# EAGLE design multiple frequency divider 1.1 (EAGLE 6.4)
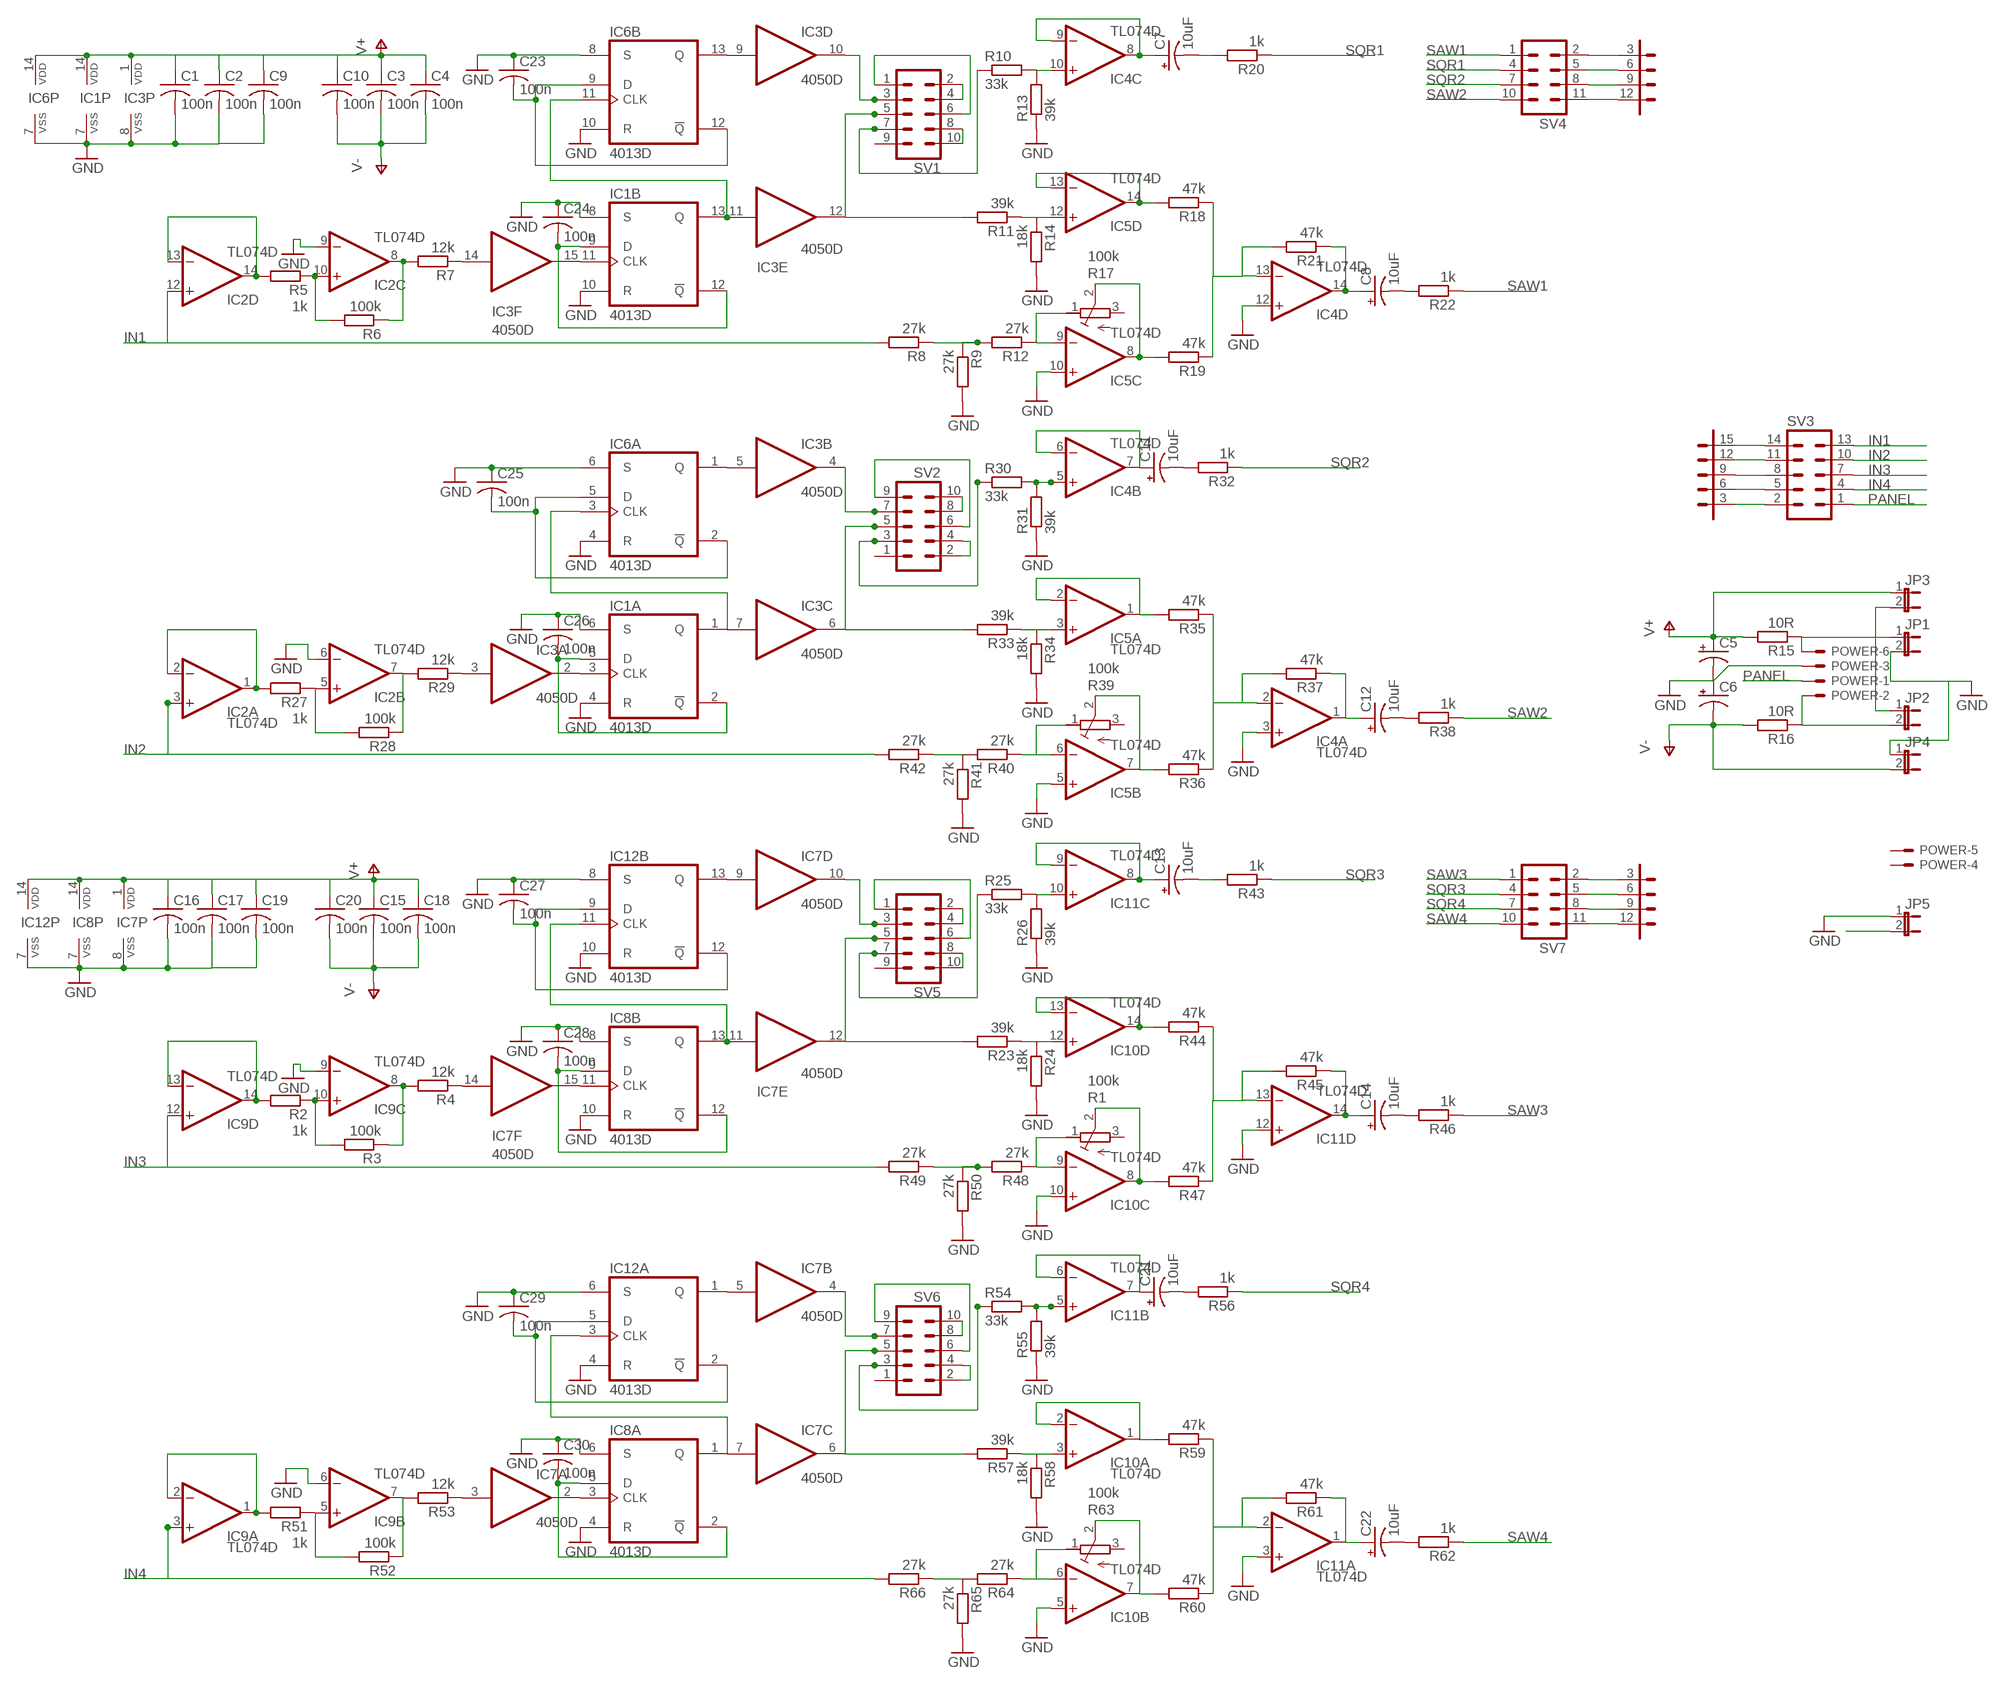
[diagram p0: schematic, sheet 1]

## Parts
C1  100n  C-US025-024X044  [C025-024X044]
C2  100n  C-US025-024X044  [C025-024X044]
C3  100n  C-US025-024X044  [C025-024X044]
C4  100n  C-US025-024X044  [C025-024X044]
C5  CPOL-USE2.5-5  [E2,5-5]
C6  CPOL-USE2.5-5  [E2,5-5]
C7  10uF  CPOL-USE2.5-5  [E2,5-5]
C8  10uF  CPOL-USE2.5-5  [E2,5-5]
C9  100n  C-US025-024X044  [C025-024X044]
C10  100n  C-US025-024X044  [C025-024X044]
C11  10uF  CPOL-USE2.5-5  [E2,5-5]
C12  10uF  CPOL-USE2.5-5  [E2,5-5]
C13  10uF  CPOL-USE2.5-5  [E2,5-5]
C14  10uF  CPOL-USE2.5-5  [E2,5-5]
C15  100n  C-US025-024X044  [C025-024X044]
C16  100n  C-US025-024X044  [C025-024X044]
C17  100n  C-US025-024X044  [C025-024X044]
C18  100n  C-US025-024X044  [C025-024X044]
C19  100n  C-US025-024X044  [C025-024X044]
C20  100n  C-US025-024X044  [C025-024X044]
C21  10uF  CPOL-USE2.5-5  [E2,5-5]
C22  10uF  CPOL-USE2.5-5  [E2,5-5]
C23  100n  C-US025-024X044  [C025-024X044]
C24  100n  C-US025-024X044  [C025-024X044]
C25  100n  C-US025-024X044  [C025-024X044]
C26  100n  C-US025-024X044  [C025-024X044]
C27  100n  C-US025-024X044  [C025-024X044]
C28  100n  C-US025-024X044  [C025-024X044]
C29  100n  C-US025-024X044  [C025-024X044]
C30  100n  C-US025-024X044  [C025-024X044]
IC1  4013D  [SO14]
IC2  TL074D  [SO14]
IC3  4050D  [SO16]
IC4  TL074D  [SO14]
IC5  TL074D  [SO14]
IC6  4013D  [SO14]
IC7  4050D  [SO16]
IC8  4013D  [SO14]
IC9  TL074D  [SO14]
IC10  TL074D  [SO14]
IC11  TL074D  [SO14]
IC12  4013D  [SO14]
JP1  JP1E  [JP1]
JP2  JP1E  [JP1]
JP3  JP1E  [JP1]
JP4  JP1E  [JP1]
JP5  JP1E  [JP1]
POWER  22-23-2061  [22-23-2061]
R1  100k  R-TRIMMT93YA  [RTRIMT93YA]
R2  1k  R-EU_0204/5  [0204/5]
R3  100k  R-EU_0204/5  [0204/5]
R4  12k  R-EU_0204/5  [0204/5]
R5  1k  R-EU_0204/5  [0204/5]
R6  100k  R-EU_0204/5  [0204/5]
R7  12k  R-EU_0204/5  [0204/5]
R8  27k  R-EU_0204/5  [0204/5]
R9  27k  R-EU_0204/5  [0204/5]
R10  33k  R-EU_0204/5  [0204/5]
R11  39k  R-EU_0204/5  [0204/5]
R12  27k  R-EU_0204/5  [0204/5]
R13  39k  R-EU_0204/5  [0204/5]
R14  18k  R-EU_0204/5  [0204/5]
R15  10R  R-EU_0207/7  [0207/7]
R16  10R  R-EU_0207/7  [0207/7]
R17  100k  R-TRIMMT93YA  [RTRIMT93YA]
R18  47k  R-EU_0204/5  [0204/5]
R19  47k  R-EU_0204/5  [0204/5]
R20  1k  R-EU_0204/5  [0204/5]
R21  47k  R-EU_0204/5  [0204/5]
R22  1k  R-EU_0204/5  [0204/5]
R23  39k  R-EU_0204/5  [0204/5]
R24  18k  R-EU_0204/5  [0204/5]
R25  33k  R-EU_0204/5  [0204/5]
R26  39k  R-EU_0204/5  [0204/5]
R27  1k  R-EU_0204/5  [0204/5]
R28  100k  R-EU_0204/5  [0204/5]
R29  12k  R-EU_0204/5  [0204/5]
R30  33k  R-EU_0204/5  [0204/5]
R31  39k  R-EU_0204/5  [0204/5]
R32  1k  R-EU_0204/5  [0204/5]
R33  39k  R-EU_0204/5  [0204/5]
R34  18k  R-EU_0204/5  [0204/5]
R35  47k  R-EU_0204/5  [0204/5]
R36  47k  R-EU_0204/5  [0204/5]
R37  47k  R-EU_0204/5  [0204/5]
R38  1k  R-EU_0204/5  [0204/5]
R39  100k  R-TRIMMT93YA  [RTRIMT93YA]
R40  27k  R-EU_0204/5  [0204/5]
R41  27k  R-EU_0204/5  [0204/5]
R42  27k  R-EU_0204/5  [0204/5]
R43  1k  R-EU_0204/5  [0204/5]
R44  47k  R-EU_0204/5  [0204/5]
R45  47k  R-EU_0204/5  [0204/5]
R46  1k  R-EU_0204/5  [0204/5]
R47  47k  R-EU_0204/5  [0204/5]
R48  27k  R-EU_0204/5  [0204/5]
R49  27k  R-EU_0204/5  [0204/5]
R50  27k  R-EU_0204/5  [0204/5]
R51  1k  R-EU_0204/5  [0204/5]
R52  100k  R-EU_0204/5  [0204/5]
R53  12k  R-EU_0204/5  [0204/5]
R54  33k  R-EU_0204/5  [0204/5]
R55  39k  R-EU_0204/5  [0204/5]
R56  1k  R-EU_0204/5  [0204/5]
R57  39k  R-EU_0204/5  [0204/5]
R58  18k  R-EU_0204/5  [0204/5]
R59  47k  R-EU_0204/5  [0204/5]
R60  47k  R-EU_0204/5  [0204/5]
R61  47k  R-EU_0204/5  [0204/5]
R62  1k  R-EU_0204/5  [0204/5]
R63  100k  R-TRIMMT93YA  [RTRIMT93YA]
R64  27k  R-EU_0204/5  [0204/5]
R65  27k  R-EU_0204/5  [0204/5]
R66  27k  R-EU_0204/5  [0204/5]
SV1  MA05-2  [MA05-2]
SV2  MA05-2  [MA05-2]
SV3  MA05-3  [MA05-3]
SV4  MA04-3  [MA04-3]
SV5  MA05-2  [MA05-2]
SV6  MA05-2  [MA05-2]
SV7  MA04-3  [MA04-3]

## Nets
GND: C1.2 C2.2 C5.- C6.+ C9.2 C16.2 C17.2 C19.2 C23.1 C24.1 C25.1 C26.1 C27.1 C28.1 C29.1 C30.1 IC1.4(A:R) IC1.6(A:S) IC1.7(P:VSS) IC1.8(B:S) IC1.10(B:R) IC2.6(B:-IN) IC2.9(C:-IN) IC3.8(P:VSS) IC4.3(A:+IN) IC4.12(D:+IN) IC5.5(B:+IN) IC5.10(C:+IN) IC6.4(A:R) IC6.6(A:S) IC6.7(P:VSS) IC6.8(B:S) IC6.10(B:R) IC7.8(P:VSS) IC8.4(A:R) IC8.6(A:S) IC8.7(P:VSS) IC8.8(B:S) IC8.10(B:R) IC9.6(B:-IN) IC9.9(C:-IN) IC10.5(B:+IN) IC10.10(C:+IN) IC11.3(A:+IN) IC11.12(D:+IN) IC12.4(A:R) IC12.6(A:S) IC12.7(P:VSS) IC12.8(B:S) IC12.10(B:R) JP1.2 JP4.1 JP5.1 POWER.3 R9.2 R13.1 R14.2 R24.2 R26.1 R31.1 R34.2 R41.2 R50.2 R55.1 R58.2 R65.2
IN1: IC2.12(D:+IN) R8.2 SV3.13
IN2: IC2.3(A:+IN) R42.2 SV3.10
IN3: IC9.12(D:+IN) R49.2 SV3.7
IN4: IC9.3(A:+IN) R66.2 SV3.4
N$1: C7.- R20.2
N$2: C8.- R22.2
N$3: IC3.12(E:O) R11.2 SV1.5
N$4: IC3.6(C:O) R33.2 SV2.5
N$5: IC2.13(D:-IN) IC2.14(D:OUT) R5.2
N$6: IC1.13(B:Q) IC3.11(E:I) IC6.11(B:CLK)
N$7: IC2.10(C:+IN) R5.1 R6.2
N$8: IC2.8(C:OUT) R6.1 R7.2
N$9: IC3.14(F:I) R7.1
N$10: IC1.11(B:CLK) IC3.15(F:O)
N$11: C24.2 IC1.9(B:D) IC1.12(B:!Q)
N$12: SV2.8 SV2.10
N$13: IC5.12(D:+IN) R11.1 R14.1
N$14: IC4.10(C:+IN) R10.2 R13.2
N$15: C7.+ IC4.8(C:OUT) IC4.9(C:-IN)
N$16: IC5.13(D:-IN) IC5.14(D:OUT) R18.2
N$17: IC5.9(C:-IN) R12.1 R17.1(A)
N$18: IC5.8(C:OUT) R17.2(S) R19.2
N$19: JP1.1 POWER.6 R15.1
N$20: R8.1 R9.1 R12.2
N$21: IC4.13(D:-IN) R18.1 R19.1 R21.2
N$22: C8.+ IC4.14(D:OUT) R21.1
N$23: JP2.2 POWER.2 R16.1
N$24: SV2.6 SV2.9
N$25: SV2.2 SV2.4
N$26: SV3.14 SV3.15
N$31: SV3.11 SV3.12
N$32: SV3.8 SV3.9
N$33: C23.2 IC6.9(B:D) IC6.12(B:!Q)
N$34: IC3.9(D:I) IC6.13(B:Q)
N$35: IC3.5(B:I) IC6.1(A:Q)
N$36: IC3.10(D:O) SV1.3
N$37: IC1.1(A:Q) IC3.7(C:I) IC6.3(A:CLK)
N$38: R10.1 SV1.7
N$39: IC2.1(A:OUT) IC2.2(A:-IN) R27.2
N$40: SV3.5 SV3.6
N$41: SV3.2 SV3.3
N$42: IC2.5(B:+IN) R27.1 R28.2
N$43: IC3.3(A:I) R29.1
N$44: IC2.7(B:OUT) R28.1 R29.2
N$45: C11.+ IC4.6(B:-IN) IC4.7(B:OUT)
N$46: C11.- R32.2
N$47: C12.- R38.2
N$48: R40.2 R41.1 R42.1
N$49: IC3.4(B:O) SV2.7
N$50: SV4.2 SV4.3
N$51: IC5.3(A:+IN) R33.1 R34.1
N$52: IC5.1(A:OUT) IC5.2(A:-IN) R35.2
N$53: IC5.6(B:-IN) R39.1(A) R40.1
N$54: IC5.7(B:OUT) R36.2 R39.2(S)
N$55: IC4.2(A:-IN) R35.1 R36.1 R37.2
N$56: C12.+ IC4.1(A:OUT) R37.1
N$57: SV4.5 SV4.6
N$58: SV4.8 SV4.9
N$59: C25.2 IC6.2(A:!Q) IC6.5(A:D)
N$60: IC1.3(A:CLK) IC3.2(A:O)
N$61: C26.2 IC1.2(A:!Q) IC1.5(A:D)
N$62: SV4.11 SV4.12
N$63: SV1.1 SV1.6
N$64: SV1.2 SV1.4
N$65: R30.1 SV2.3
N$66: IC4.5(B:+IN) R30.2 R31.2
N$67: SV1.8 SV1.10
N$68: C13.- R43.2
N$69: C14.- R46.2
N$70: IC9.13(D:-IN) IC9.14(D:OUT) R2.2
N$71: IC9.10(C:+IN) R2.1 R3.2
N$72: IC9.8(C:OUT) R3.1 R4.2
N$73: IC7.14(F:I) R4.1
N$74: IC7.15(F:O) IC8.11(B:CLK)
N$75: C28.2 IC8.9(B:D) IC8.12(B:!Q)
N$76: IC7.11(E:I) IC8.13(B:Q) IC12.11(B:CLK)
N$77: IC10.12(D:+IN) R23.1 R24.1
N$78: IC11.10(C:+IN) R25.2 R26.2
N$79: C13.+ IC11.8(C:OUT) IC11.9(C:-IN)
N$80: IC10.13(D:-IN) IC10.14(D:OUT) R44.2
N$81: IC10.9(C:-IN) R1.1(A) R48.1
N$82: IC10.8(C:OUT) R1.2(S) R47.2
N$83: R48.2 R49.1 R50.1
N$84: IC11.13(D:-IN) R44.1 R45.2 R47.1
N$85: C14.+ IC11.14(D:OUT) R45.1
N$86: C27.2 IC12.9(B:D) IC12.12(B:!Q)
N$87: IC7.10(D:O) SV5.3
N$88: R25.1 SV5.7
N$89: IC7.9(D:I) IC12.13(B:Q)
N$90: IC7.5(B:I) IC12.1(A:Q)
N$91: IC7.7(C:I) IC8.1(A:Q) IC12.3(A:CLK)
N$92: IC9.1(A:OUT) IC9.2(A:-IN) R51.2
N$93: IC9.5(B:+IN) R51.1 R52.2
N$94: IC7.3(A:I) R53.1
N$95: IC9.7(B:OUT) R52.1 R53.2
N$96: C21.+ IC11.6(B:-IN) IC11.7(B:OUT)
N$97: C21.- R56.2
N$98: C22.- R62.2
N$99: R64.2 R65.1 R66.1
N$100: IC7.4(B:O) SV6.7
N$101: IC10.3(A:+IN) R57.1 R58.1
N$102: IC10.1(A:OUT) IC10.2(A:-IN) R59.2
N$103: IC10.6(B:-IN) R63.1(A) R64.1
N$104: IC10.7(B:OUT) R60.2 R63.2(S)
N$105: IC11.2(A:-IN) R59.1 R60.1 R61.2
N$106: C22.+ IC11.1(A:OUT) R61.1
N$107: C29.2 IC12.2(A:!Q) IC12.5(A:D)
N$108: IC7.2(A:O) IC8.3(A:CLK)
N$109: C30.2 IC8.2(A:!Q) IC8.5(A:D)
N$110: R54.1 SV6.3
N$111: IC11.5(B:+IN) R54.2 R55.2
N$112: IC7.12(E:O) R23.2 SV5.5
N$113: IC7.6(C:O) R57.2 SV6.5
N$114: SV6.8 SV6.10
N$115: SV6.6 SV6.9
N$116: SV6.2 SV6.4
N$117: SV7.2 SV7.3
N$118: SV7.5 SV7.6
N$119: SV7.8 SV7.9
N$120: SV7.11 SV7.12
N$121: SV5.1 SV5.6
N$122: SV5.2 SV5.4
N$123: SV5.8 SV5.10
PANEL: JP2.1 JP3.2 JP5.2 POWER.1 SV3.1
SAW1: R22.1 SV4.1
SAW2: R38.1 SV4.10
SAW3: R46.1 SV7.1
SAW4: R62.1 SV7.10
SQR1: R20.1 SV4.4
SQR2: R32.1 SV4.7
SQR3: R43.1 SV7.4
SQR4: R56.1 SV7.7
V+: C1.1 C2.1 C3.1 C4.1 C5.+ C9.1 C10.1 C15.1 C16.1 C17.1 C18.1 C19.1 C20.1 IC1.14(P:VDD) IC3.1(P:VDD) IC6.14(P:VDD) IC7.1(P:VDD) IC8.14(P:VDD) IC12.14(P:VDD) JP3.1 R15.2
V-: C3.2 C4.2 C6.- C10.2 C15.2 C18.2 C20.2 JP4.2 R16.2
Unconnected: POWER.4 POWER.5 R1.3(E) R17.3(E) R39.3(E) R63.3(E) SV1.9 SV2.1 SV5.9 SV6.1

## Power pins joined to a net without a drawn wire
V+: IC2.4(P:V+) IC4.4(P:V+) IC5.4(P:V+) IC9.4(P:V+) IC10.4(P:V+) IC11.4(P:V+)
V-: IC2.11(P:V-) IC4.11(P:V-) IC5.11(P:V-) IC9.11(P:V-) IC10.11(P:V-) IC11.11(P:V-)

## Library data of the parts
C1-C4 C9 C10 C15-C20 C23-C30 = resistor:C-US: CAPACITOR, American symbol
C5-C8 C11-C14 C21 C22 = resistor:CPOL-US: POLARIZED CAPACITOR, American symbol
IC1 IC6 IC8 IC12 = joakim:4013: Dual D FLIP FLOP, set/reset
IC2 IC4 IC5 IC9-IC11 = linear:TL074: OP AMP
IC3 IC7 = joakim:4050: Hex non-inverting BUFFER
JP1-JP5 = jumper:JP1E: JUMPER
POWER = con-molex:22-23-2061: .100" (2.54mm) Center Header - 6 Pin; MF: MOLEX; MPN: 22-23-2061; OC_FARNELL: 1462922; OC_NEWARK: 27C1933
R1 R17 R39 R63 = resistor:R-TRIMM: Trimm resistor
R2-R14 R18-R38 R40-R62 R64-R66 = joakim:R-EU_: RESISTOR, European symbol
R15 R16 = resistor:R-EU_: RESISTOR, European symbol
SV1 SV2 SV5 SV6 = joakim:MA05-2: PIN HEADER; OC_FARNELL: unknown; OC_NEWARK: unknown
SV3 = joakim:MA05-3: PIN HEADER; OC_FARNELL: unknown; OC_NEWARK: unknown
SV4 SV7 = joakim:MA04-3: PIN HEADER

## Board
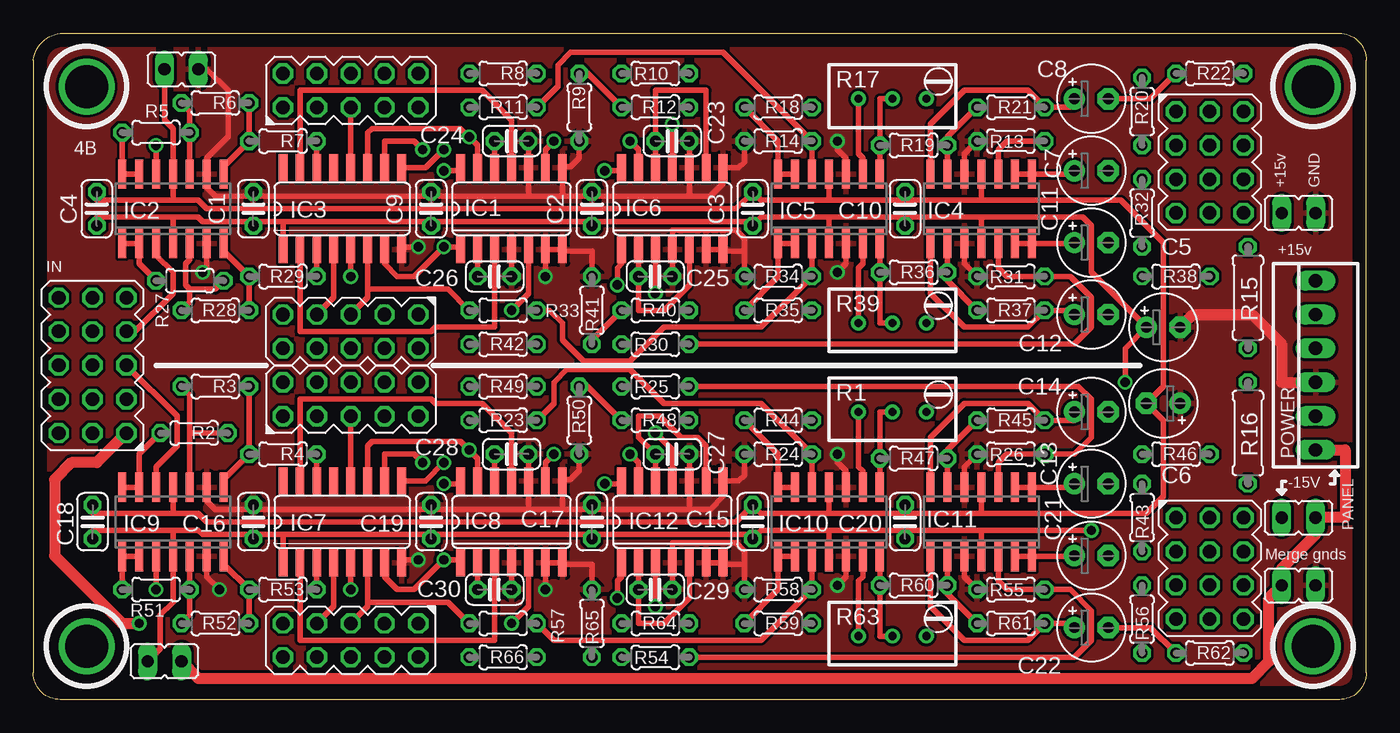
[diagram p1: board, top side]
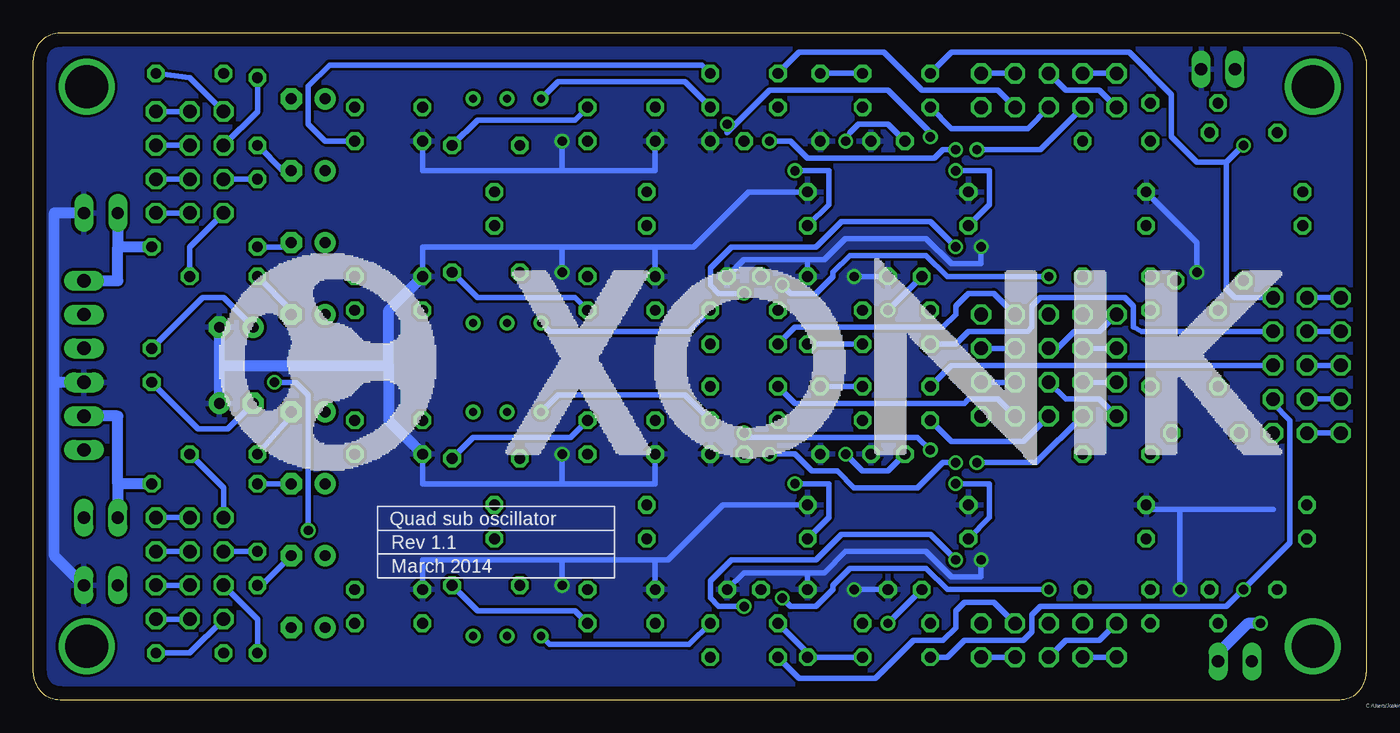
[diagram p2: board, bottom side, seen from below]

Size 100 x 50 mm. Coordinates in mm from the lower left corner, seen from the top.
Outline: 100,2 100,48 arc90 98,50 2,50 arc76 0,48 0,2 arc90 2,0 98,0 arc90 100,2
Copper layers (1*16): Top 0.035mm / dielectric 1.5mm / Bottom 0.035mm
Design rules "default": minimum track width 10mil, minimum drill 24mil, track to track 8mil, track to pad 8mil, pad to pad 8mil, via to via 8mil, smd to smd 8mil, copper to edge 40mil, drill to drill 8mil, minimum pad ring 10mil, minimum via ring 8mil, stop-mask expansion 4mil, vias tented up to drill 0mil, thermal gap 10mil

### Footprints (pad centres in the part's own frame; a part is rotated, then mirrored left to right if it is on the bottom)
C025-024X044 = drill 0.813 octagon: 1 -1.27,0; 2 1.27,0
E2,5-5 = drill 0.813 pad 1.6: + -1.27,0 | drill 0.813 pad 1.6 octagon: - 1.27,0
SO14 = smd 0.66 x 2.032: 1 -3.81,-3.073; 2 -2.54,-3.073; 3 -1.27,-3.073; 4 0,-3.073; 5 1.27,-3.073; 6 2.54,-3.073; 7 3.81,-3.073; 8 3.81,3.073; 9 2.54,3.073; 10 1.27,3.073; 11 0,3.073; 12 -1.27,3.073; 13 -2.54,3.073; 14 -3.81,3.073
SO14' = smd 0.6 x 2.2: 1 -3.81,-2.6; 2 -2.54,-2.6; 3 -1.27,-2.6; 4 0,-2.6; 5 1.27,-2.6; 6 2.54,-2.6; 7 3.81,-2.6; 8 3.81,2.6; 9 2.54,2.6; 10 1.27,2.6; 11 0,2.6; 12 -1.27,2.6; 13 -2.54,2.6; 14 -3.81,2.6
SO16 = smd 0.66 x 2.032: 1 -4.445,-3.073; 2 -3.175,-3.073; 3 -1.905,-3.073; 4 -0.635,-3.073; 5 0.635,-3.073; 6 1.905,-3.073; 7 3.175,-3.073; 8 4.445,-3.073; 9 4.445,3.073; 10 3.175,3.073; 11 1.905,3.073; 12 0.635,3.073; 13 -0.635,3.073; 14 -1.905,3.073; 15 -3.175,3.073; 16 -4.445,3.073
JP1 = drill 0.914 long: 1 0,-1.27; 2 0,1.27
22-23-2061 = drill 1 long: 1 -6.35,0; 2 -3.81,0; 3 -1.27,0; 4 1.27,0; 5 3.81,0; 6 6.35,0
RTRIMT93YA = drill 0.61: 1 0,-2.54; 2 0,0; 3 0,2.54
0204/5 = drill 0.813 octagon: 1 -2.54,0; 2 2.54,0
0207/7 = drill 0.813 octagon: 1 -3.81,0; 2 3.81,0
MA05-2 = drill 1.016 octagon: 1 -5.08,-1.27; 2 -5.08,1.27; 3 -2.54,-1.27; 4 -2.54,1.27; 5 0,-1.27; 6 0,1.27; 7 2.54,-1.27; 8 2.54,1.27; 9 5.08,-1.27; 10 5.08,1.27
MA05-3 = drill 1.016 octagon: 1 -5.08,-2.54; 2 -5.08,0; 3 -5.08,2.54; 4 -2.54,-2.54; 5 -2.54,0; 6 -2.54,2.54; 7 0,-2.54; 8 0,0; 9 0,2.54; 10 2.54,-2.54; 11 2.54,0; 12 2.54,2.54; 13 5.08,-2.54; 14 5.08,0; 15 5.08,2.54
MA04-3 = drill 1.016 octagon: 1 -3.81,-2.54; 2 -3.81,0; 3 -3.81,2.54; 4 -1.27,-2.54; 5 -1.27,0; 6 -1.27,2.54; 7 1.27,-2.54; 8 1.27,0; 9 1.27,2.54; 10 3.81,-2.54; 11 3.81,0; 12 3.81,2.54

### Placement (x,y rotation side)
C1  16.51,36.83 90 top
C2  41.91,36.83 90 top
C3  53.98,36.83 90 top
C4  4.76,36.83 90 top
C5  84.77,27.94 0 top
C6  84.77,22.23 180 top
C7  79.38,39.69 0 top
C8  79.38,45.09 0 top
C9  29.84,36.83 90 top
C10  65.41,36.83 90 top
C11  79.38,34.29 0 top
C12  79.38,28.89 0 top
C13  79.38,16.19 0 top
C14  79.38,21.59 0 top
C15  53.98,13.34 90 top
C16  16.51,13.34 90 top
C17  41.91,13.34 90 top
C18  4.45,13.34 90 top
C19  29.84,13.34 90 top
C20  65.41,13.34 90 top
C21  79.38,10.79 0 top
C22  79.38,5.4 0 top
C23  47.94,41.91 180 top
C24  35.88,41.91 180 top
C25  46.67,31.75 180 top
C26  34.61,31.75 180 top
C27  47.94,18.41 180 top
C28  35.88,18.41 180 top
C29  46.67,8.26 180 top
C30  34.61,8.26 180 top
IC1  35.88,36.83 0 top
IC2  TL074D  [SO14']  10.48,36.83 0 top
IC3  23.18,36.83 0 top
IC4  TL074D  [SO14']  71.12,36.83 0 top
IC5  TL074D  [SO14']  59.69,36.83 0 top
IC6  47.94,36.83 0 top
IC7  23.18,13.34 0 top
IC8  35.88,13.34 0 top
IC9  TL074D  [SO14']  10.48,13.34 0 top
IC10  TL074D  [SO14']  59.69,13.34 0 top
IC11  TL074D  [SO14']  71.12,13.34 0 top
IC12  47.94,13.34 0 top
JP1  94.93,36.51 270 top
JP2  94.93,13.65 90 top
JP3  9.84,2.86 270 top
JP4  11.11,47.31 90 top
JP5  94.93,8.57 90 top
POWER  96.2,25.08 90 top
R1  64.45,21.59 270 top
R2  12.06,20 180 top
R3  13.65,23.5 180 top
R4  18.73,18.41 180 top
R5  9.21,42.55 180 top
R6  13.65,44.77 180 top
R7  18.73,41.91 180 top
R8  35.24,46.99 180 top
R9  40.96,44.45 270 top
R10  46.67,46.99 0 top
R11  35.24,44.45 180 top
R12  46.67,44.45 180 top
R13  73.34,41.91 0 top
R14  55.88,41.91 180 top
R15  91.12,30.16 270 top
R16  91.12,20 90 top
R17  64.45,45.09 270 top
R18  55.88,44.45 180 top
R19  66.04,41.59 180 top
R20  83.19,44.13 270 top
R21  73.34,44.45 180 top
R22  88.27,46.99 180 top
R23  35.24,20.95 180 top
R24  55.88,18.41 180 top
R25  46.67,23.5 0 top
R26  73.34,18.41 0 top
R27  11.75,31.43 180 top
R28  13.65,29.21 180 top
R29  18.73,31.75 180 top
R30  46.67,26.67 0 top
R31  73.34,31.75 0 top
R32  83.19,36.51 270 top
R33  35.24,29.21 180 top
R34  55.88,31.75 180 top
R35  55.88,29.21 180 top
R36  66.04,32.07 180 top
R37  73.34,29.21 180 top
R38  85.72,31.75 180 top
R39  64.45,28.26 270 top
R40  46.67,29.21 180 top
R41  41.91,29.21 90 top
R42  35.24,26.67 180 top
R43  83.19,13.65 90 top
R44  55.88,20.95 180 top
R45  73.34,20.95 180 top
R46  85.72,18.41 180 top
R47  66.04,18.1 180 top
R48  46.67,20.95 180 top
R49  35.24,23.5 180 top
R50  40.96,20.95 270 top
R51  9.21,8.26 180 top
R52  13.65,5.71 180 top
R53  18.73,8.26 180 top
R54  46.67,3.17 0 top
R55  73.34,8.26 0 top
R56  83.19,6.03 90 top
R57  35.24,5.71 180 top
R58  55.88,8.26 180 top
R59  55.88,5.71 180 top
R60  66.04,8.57 180 top
R61  73.34,5.71 180 top
R62  88.27,3.49 180 top
R63  64.45,4.76 270 top
R64  46.67,5.71 180 top
R65  41.91,5.71 90 top
R66  35.24,3.17 180 top
SV1  23.81,45.72 0 top
SV2  23.81,27.62 180 top
SV3  4.45,25.08 90 top
SV4  88.27,40.32 270 top
SV5  23.81,22.54 0 top
SV6  23.81,4.45 180 top
SV7  88.27,9.84 270 top

### Tracks (layer width: path | path; a pad name or v marks a point on that pad's centre or on a via)
GND  (via drill 0.7)
  Top 0.406: 37.15,37.78 30.48,37.78 30.16,38.1 C9.2 29.53,37.78 16.83,37.78 C1.2 16.19,37.78 13.65,37.78 13.02,38.42 IC2.9 13.02,40.64 14.61,42.23 14.61,45.72 13.02,47.31 JP4.1 | 37.15,37.78 39.69,37.78 | 39.69,37.78 41.59,37.78 C2.2 42.23,37.78 49.21,37.78 | 49.21,37.78 50.8,37.78 51.75,38.73 IC6.8 52.92,39.9 53.34,40.32 R14.2 | 49.21,37.78 IC6.10 C23.1 | 39.69,37.78 IC1.8 39.69,40.01 40.32,40.01 40.96,40.64 R9.2 | 37.15,37.78 IC1.10 C24.1 | IC5.10 60.96,40.64 60.33,41.27 v60.33,41.91 | IC4.12 69.85,40.96 R13.1 | R41.2 41.91,33.66 39.79,33.66 IC1.7 IC1.6 v38.42,31.75 | IC4.3 69.85,32.7 R31.1 | IC1.4 C26.1 | IC3.8 27.62,33.97 v28.89,33.97 | C25.1 IC6.4 47.94,35.24 52.7,35.24 53.34,34.61 R34.2 53.34,33.66 52.17,33.66 IC6.7 IC6.6 | IC5.5 60.96,32.7 v60.33,32.07 | 37.15,14.29 30.16,14.29 C19.2 29.53,14.29 16.83,14.29 C16.2 16.19,14.29 13.65,14.29 13.02,14.92 IC9.9 | 37.15,14.29 39.69,14.29 | 39.69,14.29 41.59,14.29 C17.2 42.23,14.29 49.21,14.29 | 49.21,14.29 50.8,14.29 51.75,15.24 IC12.8 52.92,16.41 53.34,16.83 R24.2 | 49.21,14.29 IC12.10 C27.1 | R26.1 69.85,17.46 IC11.12 | IC11.3 69.85,9.21 R55.1 | v38.42,8.26 IC8.6 IC8.7 39.79,10.16 41.91,10.16 R65.2 | C30.1 IC8.4 | 39.69,14.29 IC8.8 39.69,16.51 40.32,16.51 40.96,17.14 R50.2 | 37.15,14.29 IC8.10 C28.1 | IC10.10 60.96,17.14 60.33,17.78 v60.33,18.41 | IC10.5 60.96,9.21 v60.33,8.57 | IC9.6 13.02,9.21 v13.97,8.26 | IC2.6 13.02,32.38 v12.7,32.07 | C29.1 IC12.4 47.94,11.75 52.7,11.75 53.34,11.11 R58.2 53.34,10.16 52.17,10.16 IC12.7 IC12.6 | v28.89,10.48 27.84,10.48 IC7.8 | IC12.6 50.48,10.48 | IC12.6 50.48,9.84
  Top 0.813: C5.- 87,28.89 91.44,28.89 93.66,26.67 93.66,23.81 POWER.3
  Bottom 0.406: 60.33,39.69 53.34,39.69 R14.2 | R13.1 70.8,39.69 60.33,39.69 | 60.33,39.69 v60.33,41.91 | R31.1 70.8,33.97 60.33,33.97 | 60.33,33.97 53.34,33.97 | C26.1 v38.42,31.75 | v28.89,33.97 28.89,32.7 31.11,32.7 33.02,34.61 39.05,34.61 40.64,33.02 41.91,33.02 | R41.2 41.91,33.02 | C25.1 46.67,33.02 41.91,33.02 | v60.33,32.07 60.33,33.97 | C2.2 46.35,38.1 50.48,33.97 53.34,33.97 | R24.2 53.34,16.19 60.33,16.19 | 60.33,16.19 70.8,16.19 R26.1 | R55.1 70.8,10.48 60.33,10.48 | C17.2 48.26,14.61 52.39,10.48 53.34,10.48 | v38.42,8.26 C30.1 | v60.33,18.41 60.33,16.19 | 6.99,14.29 13.97,14.29 | 13.97,14.29 16.19,14.29 C16.2 | v13.97,8.26 13.97,14.29 | v12.7,32.07 12.7,34.29 C1.2 | C29.1 46.67,9.53 41.91,9.53 | v28.89,10.48 28.89,9.21 31.11,9.21 33.02,11.11 39.05,11.11 40.64,9.53 41.91,9.53 | v60.33,8.57 60.33,10.48 | 60.33,10.48 53.34,10.48 | 53.34,10.48 R58.2 | R65.2 41.91,9.53 | 53.34,33.97 R34.2
  Bottom 0.813: C5.- 86.04,25.08 | 86.04,25.08 73.34,25.08 | 73.34,25.08 73.34,29.21 R31.1 | JP1.2 98.42,36.51 98.42,23.81 | 73.34,25.08 73.34,20.95 R26.1 | 86.04,25.08 C6.+ | 96.13,23.81 98.42,23.81 | JP5.1 98.42,10.79 98.42,23.81
  pour Top: 0,50.04 100.08,50.04 100.08,0 0,0
  pour Bottom: -0.76,50.55 101.09,50.55 101.09,-0.76 101.35,-1.02 -0.76,-1.02 -1.02,50.04 -0.76,50.29
IN1  (via drill 0.7)
  Top 0.406: v9.21,41.59 IC2.12
  Bottom 0.406: R8.2 31.11,48.58 17.78,48.58 14.61,45.4 14.61,42.23 12.7,40.32 10.48,40.32 | SV3.13 9.84,30.16 10.48,30.8 10.48,40.32 | 10.48,40.32 v9.21,41.59
IN2
  Top 0.406: IC2.3 9.21,33.34 10.48,32.07 10.48,30.48 7.62,27.62 SV3.10
  Bottom 0.406: R42.2 30.8,26.67 29.84,27.62 25.4,27.62 25.08,27.94 25.08,29.53 24.45,30.16 18.1,30.16 17.46,29.53 17.46,27.94 16.83,27.62 SV3.10
IN3
  Top 0.406: IC9.12 9.21,17.46 10.79,19.05 10.79,21.27 SV3.7
  Bottom 0.406: R49.2 31.11,25.08 SV3.7
IN4  (via drill 0.7)
  Top 0.406: v9.21,8.26 IC9.3
  Bottom 0.406: R66.2 31.43,3.17 30.16,4.45 25.72,4.45 25.08,5.08 25.08,6.35 24.45,6.99 10.48,6.99 v9.21,8.26 5.71,11.75 5.71,20.95 6.99,22.23 SV3.4
N$1
  Bottom 0.406: C7.- 81.28,39.69 R20.2
N$2
  Top 0.406: C8.- 83.82,45.09 R22.2
N$3
  Top 0.406: IC3.12 SV1.5
  Bottom 0.406: R11.2 31.11,42.86 25.4,42.86 SV1.5
N$4
  Top 0.406: IC3.6 25.08,30.8 | 25.08,30.8 25.08,30.16 SV2.5 | 25.08,30.8 31.11,30.8 R33.2
N$5
  Top 0.406: IC2.13 IC2.14 R5.2
N$6  (via drill 0.7)
  Top 0.406: IC3.11 25.08,42.55 25.4,42.86 32.07,42.86 v32.7,42.23 33.34,41.59 IC1.13 | IC6.11 v47.94,43.18
  Bottom 0.406: v47.94,43.18 47.94,42.55 44.77,45.72 35.88,45.72 32.7,42.55 v32.7,42.23
N$7
  Top 0.406: IC2.10 R5.1 11.75,44.13 R6.2
N$8
  Top 0.406: IC2.8 14.29,40.01 R7.2 R6.1
N$9
  Top 0.406: IC3.14 R7.1
N$10
  Top 0.406: IC3.15 20,45.72 33.66,45.72 35.88,43.5 IC1.11
N$11  (via drill 0.7)
  Top 0.406: IC1.12 C24.2 | v39.05,41.91 38.42,41.27 IC1.9
  Bottom 0.406: C24.2 35.88,43.18 38.1,43.18 38.73,42.55 v39.05,41.91
N$12
  Bottom 0.406: SV2.10 SV2.8
N$13
  Top 0.406: R11.1 39.37,46.04 39.37,47.62 40.32,48.58 51.75,48.58 R14.1 IC5.12
N$14
  Top 0.406: IC4.10 72.39,41.27 73.03,41.91 R13.2
  Bottom 0.406: R10.2 49.85,47.62 77.79,47.62 79.38,46.04 79.38,43.18 78.11,41.91 R13.2
N$15
  Top 0.406: IC4.9 IC4.8 77.98,39.43 C7.+
N$16
  Top 0.406: IC5.13 IC5.14 55.88,41.91 R18.2
N$17
  Top 0.406: IC5.9 62.23,40.64 61.91,40.96 R17.1
  Bottom 0.406: R12.1 51.12,46.35 60.64,46.35 R17.1
N$18
  Top 0.406: IC5.8 R19.2 63.5,45.09 R17.2
N$19
  Bottom 0.813: R15.1 93.66,33.97 | JP1.1 93.66,33.97 | 93.66,33.97 93.66,31.43 POWER.6
N$20
  Top 0.406: R12.2 41.59,46.99 R9.1
  Bottom 0.406: R9.1 R8.1
N$21
  Top 0.406: IC4.13 R19.1 68.58,42.23 R21.2
  Bottom 0.406: R18.1 59.37,43.5 66.67,43.5 R19.1
N$22
  Top 0.406: IC4.14 67.31,43.18 69.85,45.72 74.61,45.72 R21.1 78.11,44.45 C8.+
N$23
  Bottom 0.813: R16.1 93.66,16.19 | 93.66,16.19 JP2.2 | 93.66,16.19 93.66,21.27 POWER.2
N$24
  Bottom 0.406: SV2.9 20,27.62 21.91,27.62 23.18,26.35 SV2.6
N$25
  Bottom 0.406: SV2.2 SV2.4
N$26
  Bottom 0.406: SV3.15 SV3.14
N$27  (via drill 3.2)
  other vias: 4,46
N$28  (via drill 3.2)
  other vias: 96,46
N$29  (via drill 3.2)
  other vias: 96,4
N$30  (via drill 3.2)
  other vias: 4,4
N$31
  Bottom 0.406: SV3.12 SV3.11
N$32
  Bottom 0.406: SV3.9 SV3.8
N$33
  Top 0.406: IC6.9 50.48,45.72 46.67,45.72 C23.2 IC6.12
N$34  (via drill 0.7)
  Top 0.406: IC6.13 45.4,41.27 v44.77,41.91 | IC3.9 29.43,39.9 v30.8,41.27
  Bottom 0.406: v30.8,41.27 31.75,41.27 32.38,40.64 41.91,40.64 43.18,41.91 v44.77,41.91
N$35  (via drill 0.7)
  Top 0.406: IC3.5 v23.81,31.75 | v43.81,31.11 43.81,32.38 44.13,32.7 IC6.1
  Bottom 0.406: v23.81,31.75 31.43,31.75 33.02,33.34 38.73,33.34 40.01,32.07 40.01,31.75 41.27,30.48 43.18,30.48 v43.81,31.11
N$36  (via drill 0.7)
  Top 0.406: IC3.10 26.35,41.91 28.57,41.91 v29.21,41.27
  Bottom 0.406: v29.21,41.27 24.45,41.27 SV1.3
N$37  (via drill 0.7)
  Top 0.406: v46.67,30.48 IC6.3 | IC3.7 26.35,32.7 27.3,31.75 28.57,31.75 v30.8,33.97 31.85,33.97 IC1.1
  Bottom 0.406: v30.8,33.97 32.7,35.88 39.37,35.88 41.27,33.97 47.62,33.97 49.21,32.38 49.21,31.11 48.58,30.48 v46.67,30.48
N$38
  Bottom 0.406: R10.1 42.55,48.58 36.2,48.58 33.34,45.72 27.62,45.72 SV1.7
N$39
  Top 0.406: IC2.1 IC2.2 7.94,32.7 R27.2
N$40
  Bottom 0.406: SV3.6 SV3.5
N$41
  Bottom 0.406: SV3.3 SV3.2
N$42
  Top 0.406: 11.75,30.8 11.43,31.11 11.43,32.7 11.75,33.02 IC2.5 | R27.1 13.65,30.8 11.75,30.8 | 11.75,30.8 11.75,29.84 R28.2
N$43
  Top 0.406: 21.27,31.43 R29.1 IC3.3
N$44
  Top 0.406: IC2.7 14.29,33.66 R29.2 R28.1
N$45
  Top 0.406: IC4.6 IC4.7 78.05,34.23 C11.+
N$46
  Bottom 0.406: C11.- 80.64,33.97 R32.2
N$47
  Bottom 0.406: C12.- 80.64,29.21 R38.2
N$48
  Top 0.406: R41.1 41.91,26.99 R40.2
  Bottom 0.406: R41.1 R42.1
N$49
  Top 0.406: SV2.7 22.54,30.16 IC3.4
N$50
  Bottom 0.406: SV4.3 SV4.2
N$51
  Top 0.406: IC5.3 R34.1 54.61,27.94 47.31,27.94 44.77,25.4 41.27,25.4 39.69,26.99 39.69,28.26 38.73,29.21 R33.1
N$52
  Top 0.406: IC5.2 IC5.1 55.88,31.75 R35.2
N$53
  Top 0.406: R39.1 61.91,32.38 62.23,32.7 IC5.6
  Bottom 0.406: R39.1 61.28,27.62 50.8,27.62 R40.1
N$54
  Top 0.406: IC5.7 R36.2 63.5,28.26 R39.2
N$55
  Top 0.406: IC4.2 R36.1 68.58,31.43 R37.2
  Bottom 0.406: R35.1 59.37,30.16 66.67,30.16 R36.1
N$56
  Top 0.406: IC4.1 67.31,30.48 69.85,27.94 74.61,27.94 R37.1 78.11,29.21 C12.+
N$57
  Bottom 0.406: SV4.6 SV4.5
N$58
  Bottom 0.406: SV4.9 SV4.8
N$59
  Top 0.406: IC6.2 C25.2 45.4,29.21 47.31,29.21 49.21,31.11 IC6.5
N$60
  Top 0.406: IC3.2 20,27.62 29.84,27.62 30.16,27.94 34.61,27.94 IC1.3
N$61  (via drill 0.7)
  Top 0.406: IC1.2 C26.2 | v35.88,29.21 37.15,30.48 IC1.5
  Bottom 0.406: C26.2 v35.88,29.21
N$62
  Bottom 0.406: SV4.12 SV4.11
N$63
  Bottom 0.406: SV1.1 20,45.72 22.54,45.72 SV1.6
N$64
  Bottom 0.406: SV1.2 SV1.4
N$65
  Bottom 0.406: R30.1 42.86,27.94 31.75,27.94 30.8,28.89 30.8,29.53 29.84,30.48 27.94,30.48 SV2.3
N$66
  Top 0.406: IC4.5 72.39,32.38 73.03,31.75 R31.2 77.79,31.75 79.38,30.16 79.38,27.94 78.11,26.67 R30.2
N$67
  Bottom 0.406: SV1.10 SV1.8
N$68
  Bottom 0.406: C13.- R43.2
N$69
  Bottom 0.406: C14.- 80.64,21.27 R46.2
N$70
  Top 0.406: IC9.14 IC9.13 7.94,18.41 R2.2
N$71
  Top 0.406: 11.75,20 11.75,22.86 R3.2 | R2.1 11.75,20 | 11.75,20 IC9.10
N$72
  Top 0.406: IC9.8 14.29,16.51 R4.2 R3.1
N$73
  Top 0.406: R4.1 IC7.14
N$74
  Top 0.406: IC7.15 20,22.54 29.84,22.54 30.16,22.23 33.66,22.23 35.88,20 IC8.11
N$75  (via drill 0.7)
  Top 0.406: IC8.9 38.42,17.78 v39.05,18.41 | C28.2 IC8.12
  Bottom 0.406: v39.05,18.41 37.78,17.14 35.88,17.14 C28.2
N$76  (via drill 0.7)
  Top 0.406: IC7.11 25.08,19.05 25.4,19.37 32.07,19.37 v32.7,18.73 33.34,18.1 IC8.13 | v46.67,20 47.94,18.73 IC12.11
  Bottom 0.406: v32.7,18.73 33.66,19.68 46.35,19.68 v46.67,20
N$77
  Top 0.406: IC10.12 R24.1 54.61,22.23 47.31,22.23 44.77,24.77 40.01,24.77 39.05,23.81 39.05,22.23 R23.1
N$78
  Top 0.406: IC11.10 72.39,17.78 73.03,18.41 R26.2 78.11,18.41 79.38,19.68 79.38,22.54 78.42,23.5 R25.2
N$79
  Top 0.406: IC11.9 IC11.8 77.85,15.94 C13.+
N$80
  Top 0.406: IC10.13 IC10.14 55.88,18.41 R44.2
N$81
  Top 0.406: R1.1 61.91,17.46 62.23,17.14 IC10.9
  Bottom 0.406: R48.1 51.12,22.86 60.64,22.86 R1.1
N$82
  Top 0.406: R1.2 63.5,21.59 R47.2 IC10.8
N$83
  Top 0.406: R50.1 41.59,23.5 R48.2
  Bottom 0.406: R50.1 R49.1
N$84
  Top 0.406: IC11.13 R47.1 68.58,18.73 R45.2
  Bottom 0.406: R44.1 59.69,19.68 66.99,19.68 R47.1
N$85
  Top 0.406: C14.+ 78.11,20.95 R45.1 74.61,22.23 69.85,22.23 67.31,19.68 IC11.14
N$86
  Top 0.406: IC12.9 50.48,19.05 49.85,19.68 48.58,19.68 46.99,21.27 45.4,21.27 45.4,19.68 C27.2 IC12.12
N$87  (via drill 0.7)
  Top 0.406: IC7.10 26.35,18.41 28.57,18.41 v29.21,17.78
  Bottom 0.406: v29.21,17.78 24.77,17.78 SV5.3
N$88
  Bottom 0.406: SV5.7 27.62,22.54 29.84,22.54 30.16,22.23 42.86,22.23 R25.1
N$89  (via drill 0.7)
  Top 0.406: IC7.9 29.43,16.41 v30.8,17.78 | v44.77,18.41 45.4,17.78 IC12.13
  Bottom 0.406: v30.8,17.78 31.75,17.78 33.66,15.88 38.42,15.88 39.69,17.14 41.59,17.14 42.86,18.41 v44.77,18.41
N$90  (via drill 0.7)
  Top 0.406: IC12.1 44.13,9.21 43.81,8.89 v43.81,7.62 | IC7.5 v23.81,8.26
  Bottom 0.406: v23.81,8.26 31.43,8.26 33.02,9.84 38.73,9.84 40.01,8.57 40.01,8.26 41.27,6.99 43.18,6.99 v43.81,7.62
N$91  (via drill 0.7)
  Top 0.406: IC12.3 v46.67,6.99 | 31.97,10.16 IC8.1 31.85,10.48 v30.8,10.48 28.57,8.26 27.3,8.26 26.35,9.21 IC7.7
  Bottom 0.406: v46.67,6.99 48.58,6.99 49.21,7.62 49.21,8.89 47.62,10.48 41.27,10.48 39.37,12.38 32.7,12.38 v30.8,10.48
N$92
  Top 0.406: IC9.2 IC9.1 R51.2
N$93
  Top 0.406: R52.2 11.75,6.35 R51.1 IC9.5
N$94
  Top 0.406: R53.1 IC7.3
N$95
  Top 0.406: 14.29,11.11 IC9.7 14.29,10.16 R53.2 R52.1
N$96
  Top 0.406: IC11.6 IC11.7 78.05,10.73 C21.+
N$97
  Bottom 0.406: C21.- 82.87,8.57 R56.2
N$98
  Top 0.406: C22.- 83.82,5.4 R62.2
N$99
  Bottom 0.406: R66.1 R65.1 41.91,3.49 R64.2
N$100
  Top 0.406: SV6.7 22.54,6.99 IC7.4
N$101
  Top 0.406: IC10.3 R58.1 54.61,4.45 39.05,4.45 R57.1
N$102
  Top 0.406: R59.2 55.88,8.26 IC10.1 IC10.2
N$103
  Top 0.406: R63.1 61.91,8.89 62.23,9.21 IC10.6
  Bottom 0.406: R64.1 50.8,4.13 61.28,4.13 R63.1
N$104
  Top 0.406: IC10.7 R60.2 63.5,4.76 R63.2
N$105
  Top 0.406: IC11.2 R60.1 68.58,7.94 R61.2
  Bottom 0.406: R59.1 59.37,6.67 66.67,6.67 R60.1
N$106
  Top 0.406: IC11.1 67.31,6.99 69.85,4.45 74.61,4.45 R61.1 77.79,5.71 C22.+
N$107
  Top 0.406: IC12.5 49.21,7.62 47.31,5.71 45.4,5.71 C29.2 IC12.2
N$108
  Top 0.406: IC8.3 34.61,4.45 20,4.45 IC7.2
N$109  (via drill 0.7)
  Top 0.406: IC8.2 C30.2 | v35.88,5.71 37.15,6.99 IC8.5
  Bottom 0.406: C30.2 v35.88,5.71
N$110
  Bottom 0.406: SV6.3 27.94,7.3 30.16,7.3 30.8,6.67 30.8,5.4 31.75,4.45 33.97,4.45 36.83,1.59 42.55,1.59 R54.1
N$111
  Top 0.406: IC11.5 72.39,8.89 73.03,8.26 R55.2 77.79,8.26 79.38,6.67 79.38,4.45 78.11,3.17 R54.2
N$112
  Top 0.406: IC7.12 SV5.5
  Bottom 0.406: SV5.5 25.72,19.37 31.11,19.37 R23.2
N$113
  Top 0.406: SV6.5 25.08,6.99 25.08,7.3 | 25.08,7.3 IC7.6 | R57.2 31.11,7.3 25.08,7.3
N$114
  Bottom 0.406: SV6.10 SV6.8
N$115
  Bottom 0.406: SV6.9 20,4.45 22.54,4.45 SV6.6
N$116
  Bottom 0.406: SV6.4 SV6.2
N$117
  Bottom 0.406: SV7.2 SV7.3
N$118
  Bottom 0.406: SV7.5 SV7.6
N$119
  Bottom 0.406: SV7.8 SV7.9
N$120
  Bottom 0.406: SV7.11 SV7.12
N$121
  Bottom 0.406: SV5.1 20,22.54 22.54,22.54 SV5.6
N$122
  Bottom 0.406: SV5.2 SV5.4
N$123
  Bottom 0.406: SV5.8 SV5.10
PANEL  (via drill 0.7)
  Top 0.813: POWER.1 98.42,18.73 98.42,13.65 JP2.1 96.2,12.38 93.66,9.84 JP5.2 92.71,7.62 92.71,2.86 91.44,1.59 12.38,1.59 JP3.2 | SV3.1 4.76,17.78 2.86,17.78 1.59,16.51 1.59,10.79 6.67,5.71 v7.94,5.71
  Bottom 0.813: v7.94,5.71 8.89,5.71 11.11,3.49 JP3.2
SAW1
  Bottom 0.406: R22.1 88.27,46.67 SV4.1
SAW2
  Bottom 0.406: R38.1 88.27,33.97 SV4.10
SAW3
  Bottom 0.406: R46.1 85.72,15.88 SV7.1
SAW4
  Bottom 0.406: R62.1 88.27,3.49 SV7.10
SQR1
  Bottom 0.406: R20.1 83.19,44.13 SV4.4
SQR2
  Bottom 0.406: SV4.7 R32.1
SQR3
  Bottom 0.406: R43.1 SV7.4
SQR4
  Bottom 0.406: R56.1 83.19,6.03 SV7.7
V+  (via drill 0.7)
  Top 0.406: IC2.4 10.48,36.2 | 10.48,36.2 12.38,36.2 12.7,35.88 16.51,35.88 | C1.1 16.51,35.88 | 16.51,35.88 18.73,35.88 | 18.73,35.88 IC3.1 | C4.1 4.76,36.2 10.48,36.2 | 18.73,35.88 29.53,35.88 C9.1 29.84,35.88 41.59,35.88 C2.1 42.23,35.88 53.66,35.88 C3.1 54.61,36.2 59.69,36.2 | 59.69,36.2 65.41,36.2 | C10.1 65.41,36.2 | 65.41,36.2 71.12,36.2 | 71.12,36.2 78.74,36.2 79.38,35.56 79.38,32.07 C5.+ 81.92,26.35 v81.92,23.81 | IC4.4 71.12,36.2 | IC5.4 59.69,36.2 | v30.8,39.69 31.85,39.69 IC1.14 | 65.41,12.7 59.69,12.7 | 59.69,12.7 54.61,12.7 C15.1 53.66,12.38 42.23,12.38 C17.1 41.59,12.38 30.16,12.38 C19.1 29.53,12.38 18.73,12.38 | 18.73,12.38 16.83,12.38 C16.1 16.19,12.38 12.7,12.38 12.38,12.7 10.48,12.7 | 10.48,12.7 4.45,12.7 C18.1 | 10.48,12.7 IC9.4 10.48,7.3 9.53,6.35 9.53,3.81 JP3.1 | IC7.1 18.73,12.38 | C20.1 65.41,12.7 | 65.41,12.7 71.12,12.7 | IC10.4 59.69,12.7 | v30.8,16.19 31.85,16.19 IC8.14 | 71.12,12.7 v79.38,12.7 | IC11.4 71.12,12.7 | IC12.14 44.13,16.19 | v42.86,16.19 44.13,16.19 | 44.13,16.19 44.13,15.88 | v42.86,39.69 43.92,39.69 IC6.14
  Bottom 0.406: v30.8,39.69 28.26,39.69 28.26,37.15 C9.1 | C5.+ 85.72,30.16 87.31,30.16 R15.2 | v30.8,16.19 28.26,16.19 28.26,13.65 C19.1 | v79.38,12.7 79.38,22.86 80.33,23.81 v81.92,23.81 | v42.86,16.19 40.32,16.19 40.32,13.65 C17.1 | v42.86,39.69 40.32,39.69 40.32,37.15 C2.1
V-
  Top 0.406: C4.2 4.76,37.47 10.48,37.47 | 10.48,37.47 IC2.11 10.48,42.86 9.84,43.5 JP4.2 | 10.48,37.47 12.38,37.47 13.02,36.83 52.7,36.83 C3.2 54.61,37.47 59.69,37.47 | 59.69,37.47 IC5.11 | 65.41,37.47 59.69,37.47 | C10.2 65.41,37.47 | 65.41,37.47 71.12,37.47 | IC4.11 71.12,37.47 | 71.12,37.47 81.6,37.47 84.77,34.29 84.77,23.5 C6.- 84.77,20.95 84.77,15.24 83.5,13.97 71.12,13.97 | 65.41,13.97 59.69,13.97 | 59.69,13.97 54.61,13.97 C15.2 52.7,13.34 13.02,13.34 12.38,13.97 10.48,13.97 | C20.2 65.41,13.97 | 65.41,13.97 71.12,13.97 | C18.2 4.45,13.97 10.48,13.97 | IC9.11 10.48,13.97 | IC10.11 59.69,13.97 | IC11.11 71.12,13.97
  Bottom 0.406: R16.2 87.63,20.32 85.41,20.32 C6.-

### Text on the board
tPlace: Merge gnds
tNames: 4B | +15v | GND | +15v | IN | -15V | PANEL
bNames: Quad sub oscillator | Rev 1.1 | March 2014 | C:/Users/Joakim/Documents/eagle/Logos/xonik-logo-monocrome-80 mm 200 dpi.bmp